# EAGLE board pcb-pick-plaz-control_v1d (EAGLE 9.6.2)
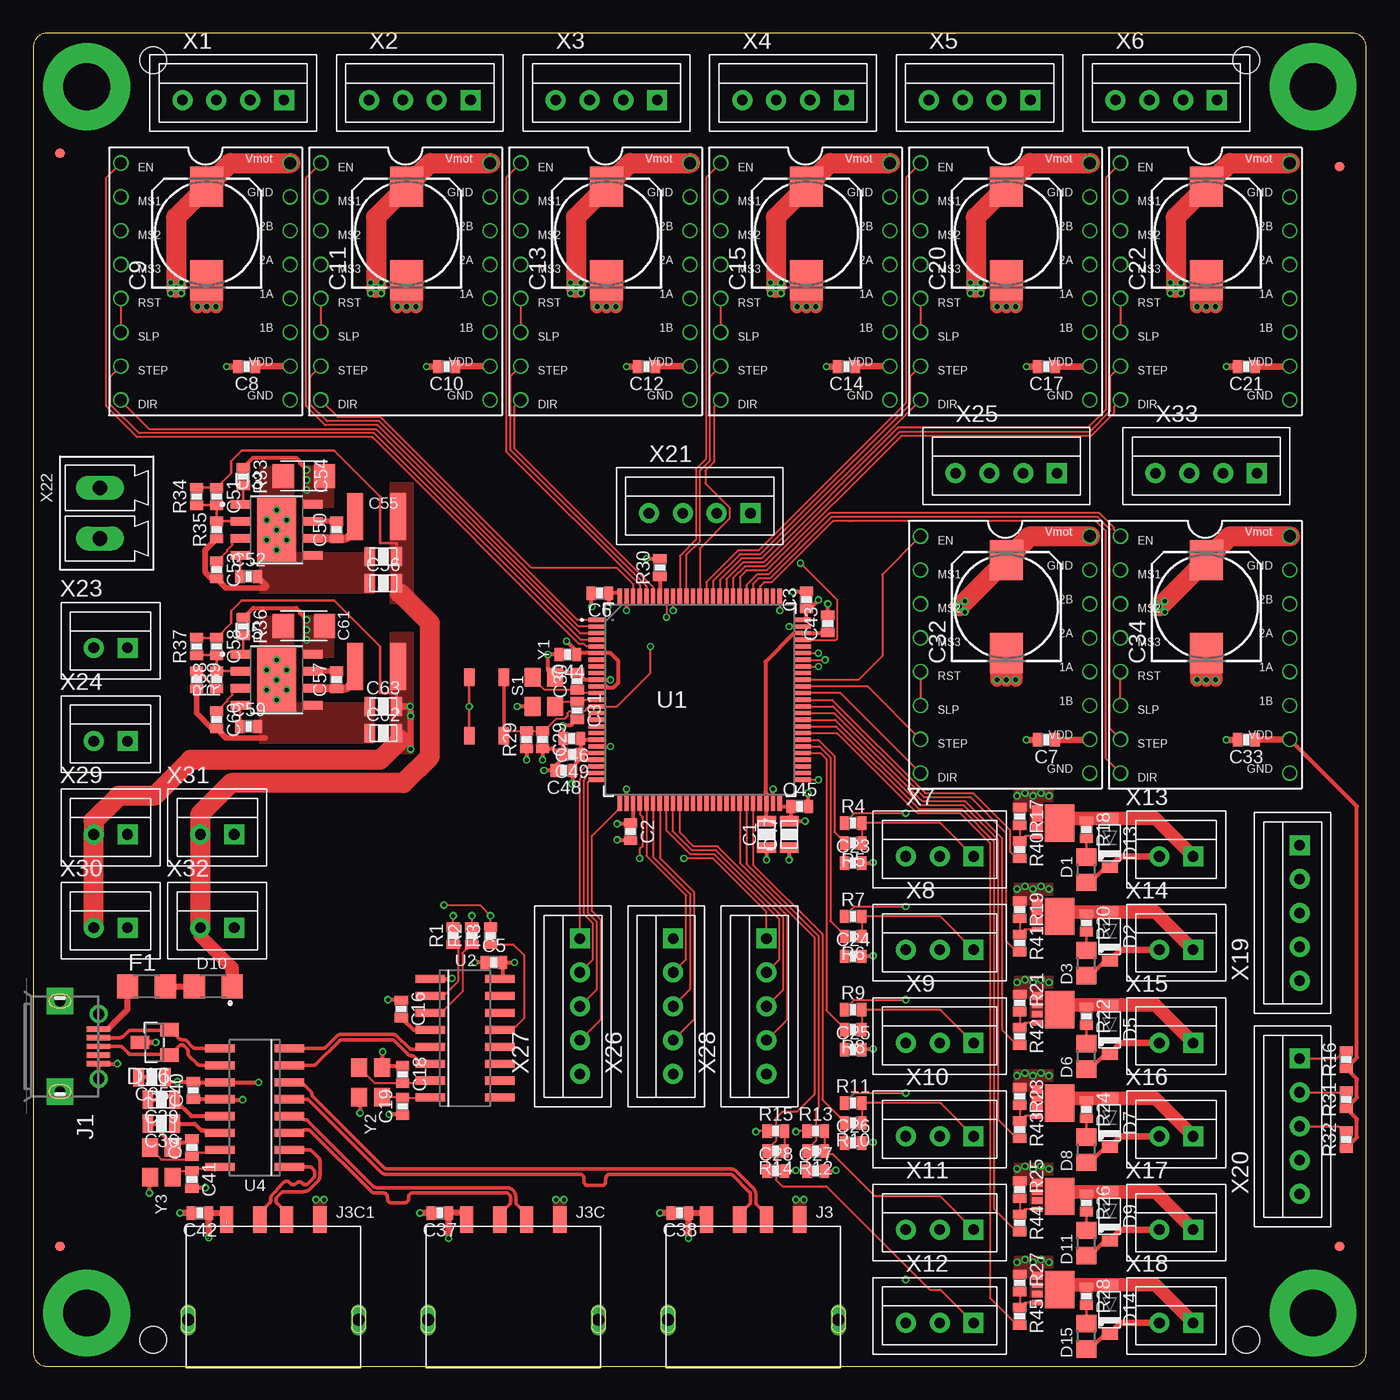
[diagram p5: board, top side]
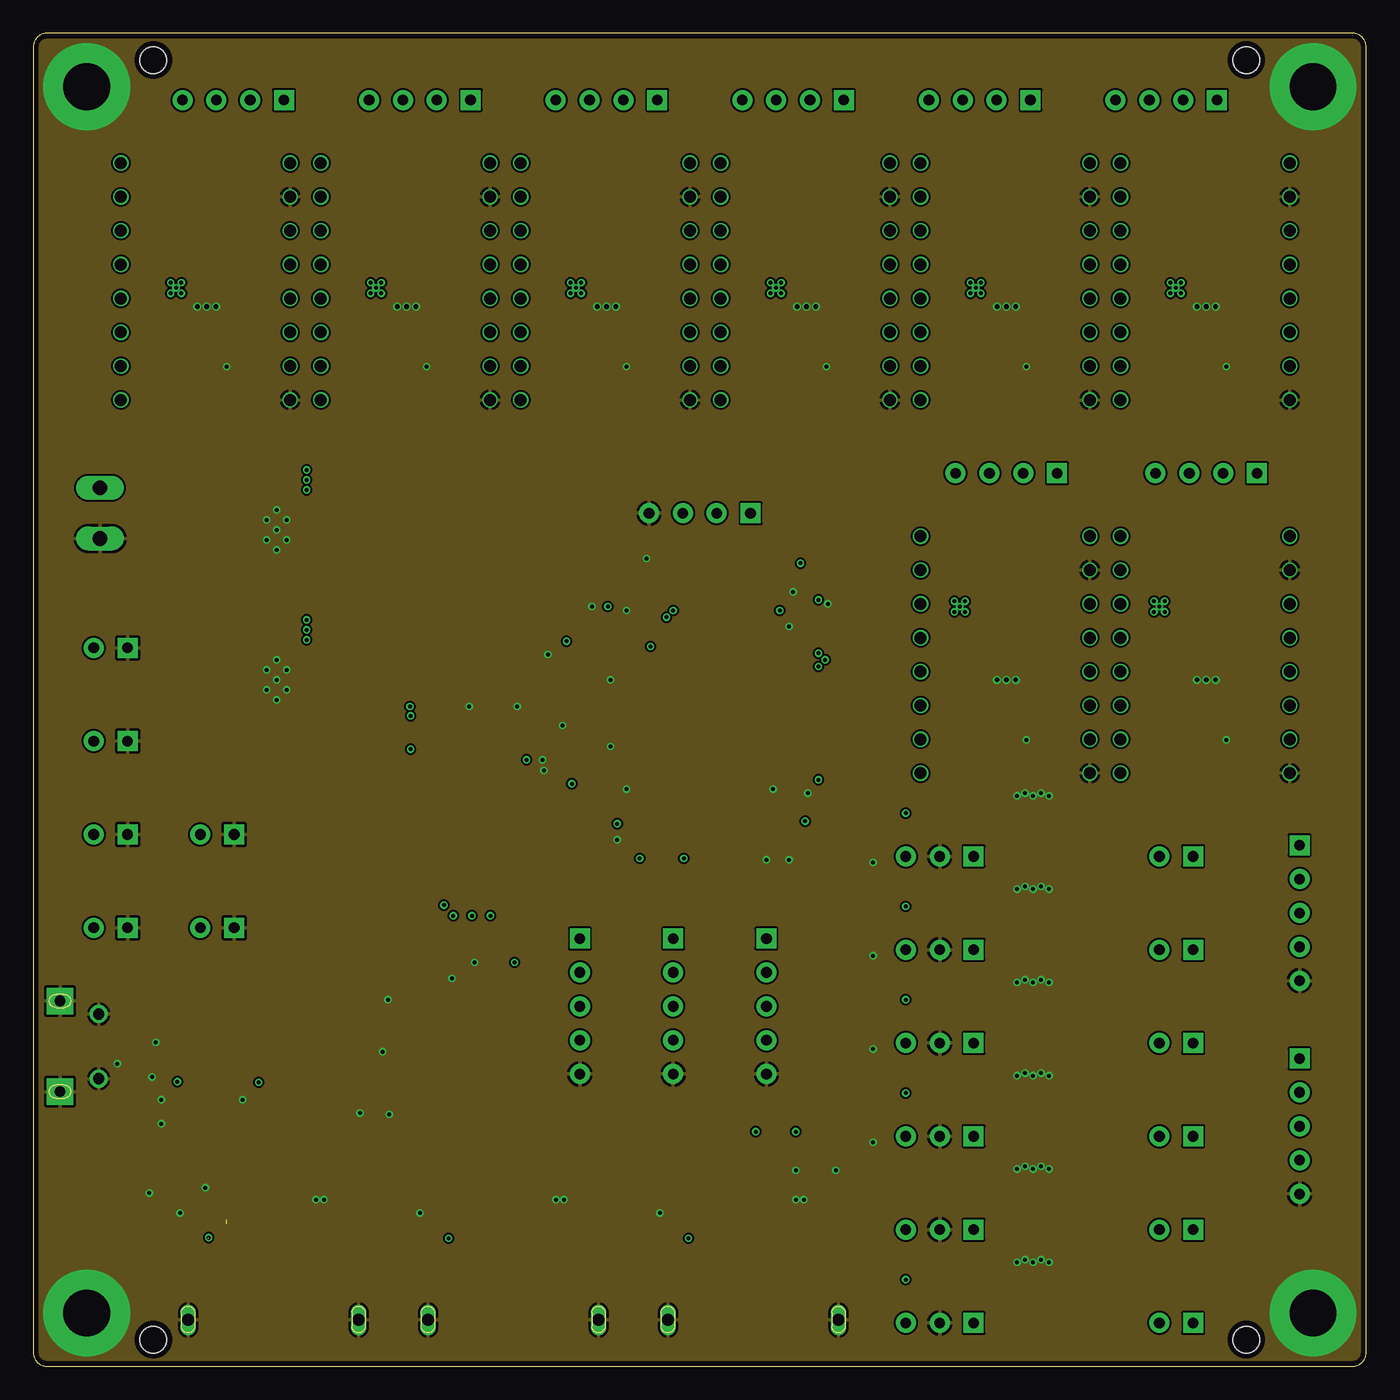
[diagram p6: board, inner layer Route2]
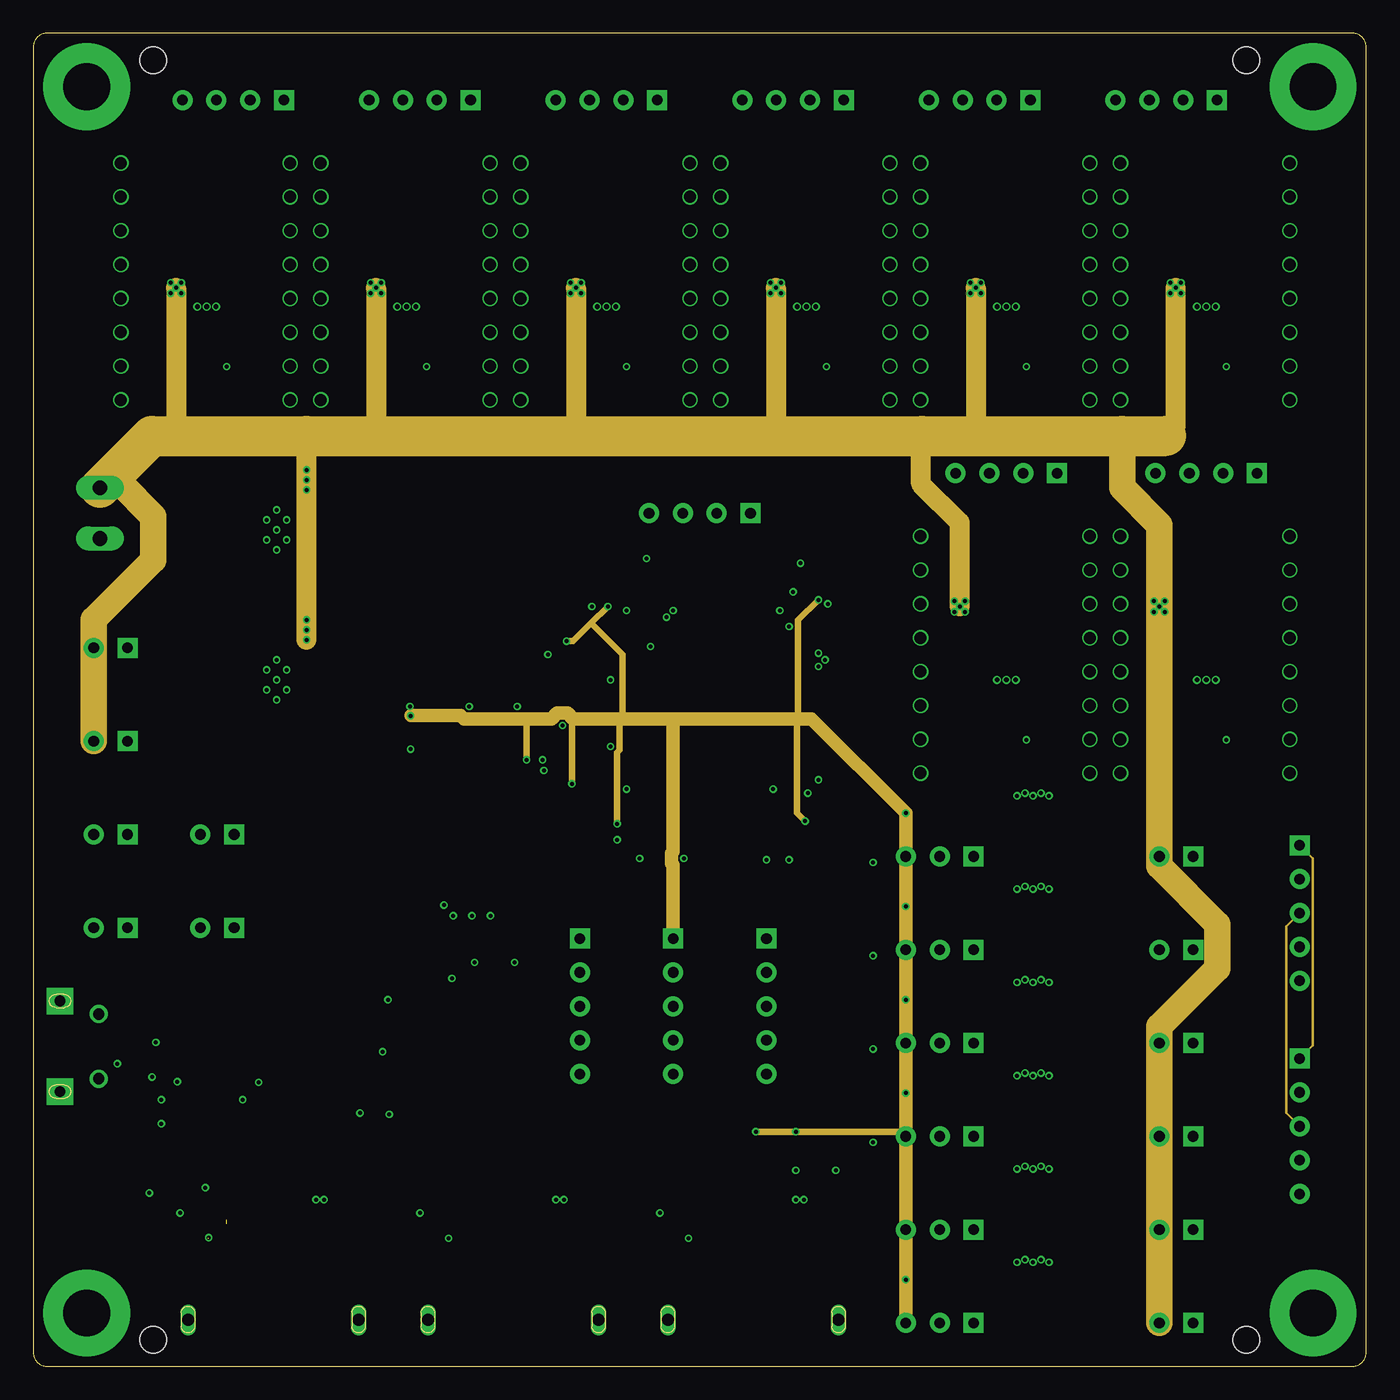
[diagram p7: board, inner layer Route15]
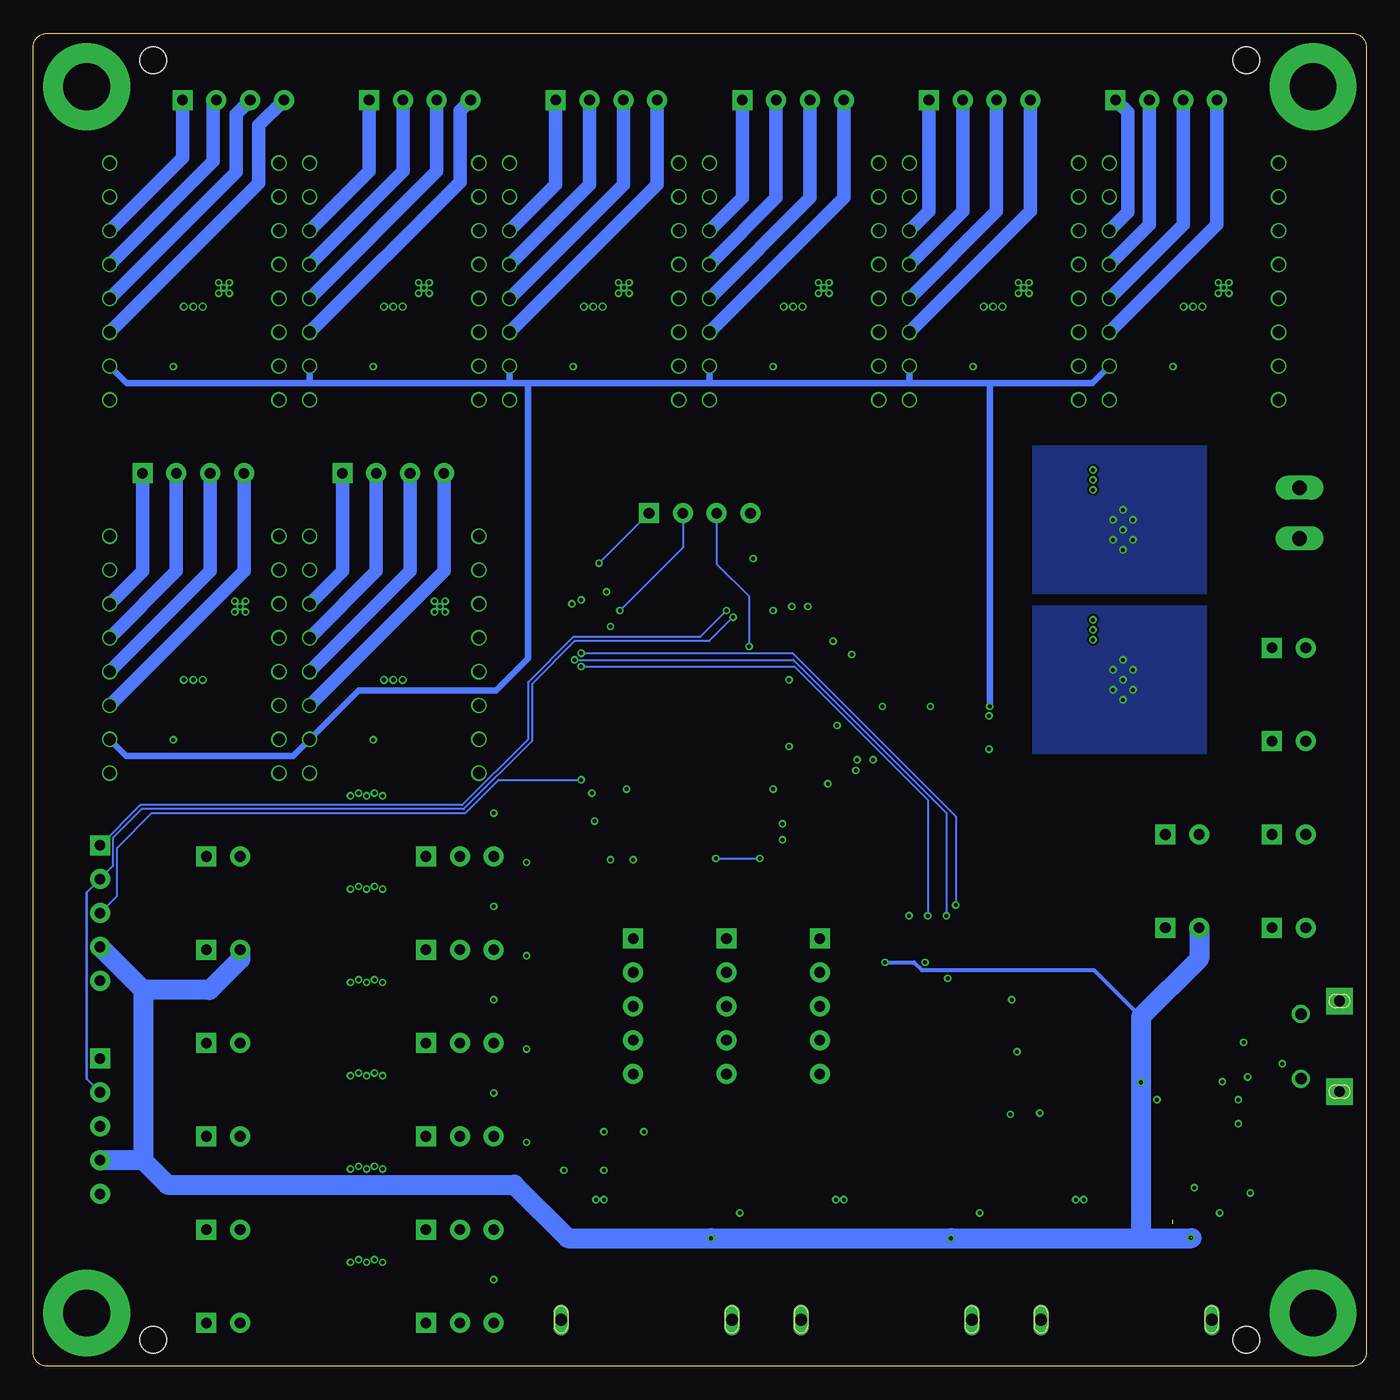
[diagram p8: board, bottom side, seen from below]

Size 100 x 100 mm. Coordinates in mm from the lower left corner, seen from the top.
Outline: 0,99 0,1 arc90 1,0 99,0 arc90 100,1 100,99 arc90 99,100 1,100 arc90 0,99
Copper layers (1+2*15+16): Top 0.035mm / dielectric 0.2mm / Route2 0.035mm / dielectric 1.06mm / Route15 0.035mm / dielectric 0.2mm / Bottom 0.035mm
Design rules "default *": minimum track width 0.15mm, minimum drill 0.2mm, track to track 0.15mm, track to pad 0.15mm, pad to pad 0.15mm, via to via 0.15mm, smd to smd 0.15mm, copper to edge 0.4mm, drill to drill 10mil, minimum pad ring 0.125mm, minimum via ring 0.125mm, stop-mask expansion 0.05mm, vias tented up to drill 0.35mm, thermal gap 0.2mm
Net classes: 1 usb: width 0.25 mm, clearance 0.4 mm to class 0, clearance 0.15 mm; 2 power: width 0.3 mm, clearance 0.3 mm to class 0, clearance 0.3 mm to class 1, clearance 0.3 mm; 3 gnd: clearance 0.5 mm to class 1, clearance 0.5 mm to class 2
Holes 2 mm at 9,98 91,98 91,2 9,2

## Footprints (pad centres in the part's own frame; a part is rotated, then mirrored left to right if it is on the bottom)
0805_CAP = smd 0.8 x 1.4: P$1 1,0; P$2 -1,0
0603_CAP = smd 0.7 x 1: 1 -0.65,0; 2 0.65,0
175TMP-0808 = smd 3 x 2.5: + 3.5,0; - -3.5,0
1206_CAP = smd 1.8 x 1.6: 1 0,1.55; 2 0,-1.55
0805-DOT = smd 1.3 x 1.5: 1 -0.95,0; 2 0.95,0
SOD123 = smd 0.8 x 1.2: A -1.85,0; K 1.85,0
1206-DOT = smd 1.6 x 1.803: 1 -1.422,0; 2 1.422,0
SOT-23 = smd 1.4 x 1: 1 1.1,-0.95; 2 1.1,0.95; 3 -1.1,0
R1206 = smd 1.6 x 1.803: 1 -1.422,0; 2 1.422,0
USB-MICRO-THT = smd 0.4 x 1.75: 1 -1.3,2.875; 2 -0.65,2.875; 3 0,2.875; 4 0.65,2.875; 5 1.3,2.875 | drill 0.8 pad 2 square: GND1 -3.4,0; GND2 3.4,0 | drill 0.85 pad 1.35: GND3 -2.425,2.9; GND4 2.425,2.9
USB-A-LCSC_C42431 = drill 0.9 long: COM1 6.4,-7.53; COM2 -6.4,-7.53 | smd 1 x 2: D+ 1,0; D- -1,0; GND 3.5,0; VCC -3.5,0
IND_CR4 = smd 3.5 x 1.2: P$1 0,1.6; P$2 0,-1.6
0603-RES = smd 0.7 x 1: 1 -0.65,0; 2 0.65,0
SWITCH_WH = smd 1.3 x 0.8: 1A -2.2,1.3; 1B 2.2,1.3; 2A -2.2,-1.3; 2B 2.2,-1.3
LQFP100-14X14MM = smd 1.194 x 0.305: 1 -7.75,6; 2 -7.75,5.5; 3 -7.75,5; 4 -7.75,4.5; 5 -7.75,4; 6 -7.75,3.5; 7 -7.75,3; 8 -7.75,2.5; 9 -7.75,2; 10 -7.75,1.5; 11 -7.75,1; 12 -7.75,0.5; 13 -7.75,0; 14 -7.75,-0.5; 15 -7.75,-1; 16 -7.75,-1.5; 17 -7.75,-2; 18 -7.75,-2.5; 19 -7.75,-3; 20 -7.75,-3.5; 21 -7.75,-4; 22 -7.75,-4.5; 23 -7.75,-5; 24 -7.75,-5.5; 25 -7.75,-6; 51 7.75,-6; 52 7.75,-5.5; 53 7.75,-5; 54 7.75,-4.5; 55 7.75,-4; 56 7.75,-3.5; 57 7.75,-3; 58 7.75,-2.5; 59 7.75,-2; 60 7.75,-1.5; 61 7.75,-1; 62 7.75,-0.5; 63 7.75,0; 64 7.75,0.5; 65 7.75,1; 66 7.75,1.5; 67 7.75,2; 68 7.75,2.5; 69 7.75,3; 70 7.75,3.5; 71 7.75,4; 72 7.75,4.5; 73 7.75,5; 74 7.75,5.5; 75 7.75,6 | smd 0.305 x 1.194: 26 -6,-7.75; 27 -5.5,-7.75; 28 -5,-7.75; 29 -4.5,-7.75; 30 -4,-7.75; 31 -3.5,-7.75; 32 -3,-7.75; 33 -2.5,-7.75; 34 -2,-7.75; 35 -1.5,-7.75; 36 -1,-7.75; 37 -0.5,-7.75; 38 0,-7.75; 39 0.5,-7.75; 40 1,-7.75; 41 1.5,-7.75; 42 2,-7.75; 43 2.5,-7.75; 44 3,-7.75; 45 3.5,-7.75; 46 4,-7.75; 47 4.5,-7.75; 48 5,-7.75; 49 5.5,-7.75; 50 6,-7.75; 76 6,7.75; 77 5.5,7.75; 78 5,7.75; 79 4.5,7.75; 80 4,7.75; 81 3.5,7.75; 82 3,7.75; 83 2.5,7.75; 84 2,7.75; 85 1.5,7.75; 86 1,7.75; 87 0.5,7.75; 88 0,7.75; 89 -0.5,7.75; 90 -1,7.75; 91 -1.5,7.75; 92 -2,7.75; 93 -2.5,7.75; 94 -3,7.75; 95 -3.5,7.75; 96 -4,7.75; 97 -4.5,7.75; 98 -5,7.75; 99 -5.5,7.75; 100 -6,7.75
SOIC-16 = smd 0.61 x 2.21: 1 -4.445,-2.616; 2 -3.175,-2.616; 3 -1.905,-2.616; 4 -0.635,-2.616; 5 0.635,-2.616; 6 1.905,-2.616; 7 3.175,-2.616; 8 4.445,-2.616; 9 4.445,2.616; 10 3.175,2.616; 11 1.905,2.616; 12 0.635,2.616; 13 -0.635,2.616; 14 -1.905,2.616; 15 -3.175,2.616; 16 -4.445,2.616
TPS54227DDAR_VREG_LM5017MR/NOPB = smd 1.55 x 0.6: 1 -2.7,1.905; 2 -2.7,0.635; 3 -2.7,-0.635; 4 -2.7,-1.905; 5 2.7,-1.905; 6 2.7,-0.635; 7 2.7,0.635; 8 2.7,1.905 | smd 2.95 x 4.9: 9 0,0
A4988BREAKOUT = drill 0.9: 1A 8.89,1.27; 1B 11.43,1.27; 2A 6.35,1.27; 2B 3.81,1.27; DIR 16.51,-11.43; EN -1.27,-11.43; GND 16.51,1.27; GND@0 1.27,1.27; MS1 1.27,-11.43; MS2 3.81,-11.43; MS3 6.35,-11.43; RST 8.89,-11.43; SLP 11.43,-11.43; STEP 13.97,-11.43; VDD 13.97,1.27; VMOT -1.27,1.27
DFN3030-8B = smd 2.8 x 2.2: D 0,0.5 | smd 0.4 x 0.8: G 0.975,-1.2; S2 -0.325,-1.2 | smd 0.6 x 0.8: S1 -1.025,-1.2 | smd 0.5 x 0.8: S3 0.325,-1.2
FIDUCIAL_2MM = smd 0.7 x 0.7: V 0,0
B4B-XH = drill 0.8 pad 1.5 square: P$1 3.81,0 | drill 0.8 pad 1.5: P$2 1.27,0; P$3 -1.27,0; P$4 -3.81,0
B3B-XH = drill 0.8 pad 1.5 square: P$1 2.54,0 | drill 0.8 pad 1.5: P$2 0,0; P$3 -2.54,0
B2B-XH = drill 0.8 pad 1.5 square: P$1 1.27,0 | drill 0.8 pad 1.5: P$2 -1.27,0
B5B-XH = drill 0.8 pad 1.5 square: P$1 5.08,0 | drill 0.8 pad 1.5: P$2 2.54,0; P$3 0,0; P$4 -2.54,0; P$5 -5.08,0
PIN_2X1_3.81MM_LONGPAD = drill 1.1 pad 1.8 long: 1 -1.905,0; 2 1.905,0
3225-QUARZ = smd 1.4 x 1.2: 1 -1.1,-0.85; 2_GND 1.1,-0.85; 3 1.1,0.85; 4_GND -1.1,0.85

## Placement (x,y rotation side)
C1  4.7u  [0805_CAP]  55,39.9 90 top
C2  100n  [0603_CAP]  44.8,40.1 270 top
C3  100n  [0603_CAP]  58,57.5 90 top
C4  22p  [0603_CAP]  11.9,16.4 90 top
C5  100n  [0603_CAP]  34.55,30.3 0 top
C6  100n  [0603_CAP]  42.5,58 180 top
C7  [0603_CAP]  76,47 180 top
C8  [0603_CAP]  16,75 180 top
C9  [175TMP-0808]  13,85 90 top
C10  [0603_CAP]  31,75 180 top
C11  [175TMP-0808]  28,85 90 top
C12  [0603_CAP]  46,75 180 top
C13  [175TMP-0808]  43,85 90 top
C14  [0603_CAP]  61,75 180 top
C15  [175TMP-0808]  58,85 90 top
C16  100n  [0603_CAP]  27.6,26.8 270 top
C17  [0603_CAP]  76,75 180 top
C18  22p  [0603_CAP]  27.7,21.9 270 top
C19  22p  [0603_CAP]  27.7,19.5 90 top
C20  [175TMP-0808]  73,85 90 top
C21  [0603_CAP]  91,75 180 top
C22  [175TMP-0808]  88,85 90 top
C23  100n  [0603_CAP]  61.5,37.75 0 top
C24  100n  [0603_CAP]  61.5,30.75 0 top
C25  100n  [0603_CAP]  61.5,23.75 0 top
C26  100n  [0603_CAP]  61.5,16.75 0 top
C27  100n  [0603_CAP]  58.7,14.65 0 top
C28  100n  [0603_CAP]  55.7,14.65 0 top
C29  100n  [0603_CAP]  38.2,47 270 top
C30  10p  [0603_CAP]  40.8,51.4 90 top
C31  10p  [0603_CAP]  40.8,49.2 270 top
C32  [175TMP-0808]  73,57 90 top
C33  [0603_CAP]  91,47 180 top
C34  [175TMP-0808]  88,57 90 top
C35  10u  [0805_CAP]  8.9,21.7 180 top
C36  10u  [0805_CAP]  9.6,18.2 180 top
C37  100n  [0603_CAP]  30.5,11.5 180 top
C38  100n  [0603_CAP]  48.5,11.5 180 top
C39  10u  [0805_CAP]  9.6,20 180 top
C40  100n  [0603_CAP]  12,20.7 90 top
C41  22p  [0603_CAP]  11.9,14 270 top
C42  100n  [0603_CAP]  12.5,11.5 180 top
C43  100n  [0603_CAP]  59.6,55.7 90 top
C44  100n  [0603_CAP]  40.1,53.4 180 top
C45  100n  [0603_CAP]  57.5,42 0 top
C46  100n  [0603_CAP]  40.4,47.1 180 top
C47  4.7u  [0805_CAP]  56.7,39.9 90 top
C48  100n  [0603_CAP]  39.8,44.7 180 top
C49  100n  [0603_CAP]  40.4,45.9 180 top
C50  100n  [0603_CAP]  22.75,62.75 90 top
C51  10p  [0603_CAP]  13.75,65.25 270 top
C52  3.3n  [0603_CAP]  16.15,59.25 0 top
C53  1u  [0603_CAP]  13.75,59.75 270 top
C54  22uF  [1206_CAP]  20.3,66.8 270 top
C55  22uF  [0805_CAP]  26.25,60.75 0 top
C56  22uF  [0805_CAP]  26.25,58.75 0 top
C57  100n  [0603_CAP]  22.75,51.5 90 top
C58  10p  [0603_CAP]  13.75,54 270 top
C59  3.3n  [0603_CAP]  16.15,48 0 top
C60  1u  [0603_CAP]  13.75,48.5 270 top
C61  22uF  [1206_CAP]  20.3,55.55 270 top
C62  22uF  [0805_CAP]  26.25,47.5 0 top
C63  22uF  [0805_CAP]  26.25,49.5 0 top
D1  LED-0805  [0805-DOT]  79,37.25 90 top
D2  [SOD123]  80.75,32.25 270 top
D3  LED-0805  [0805-DOT]  79,30.25 90 top
D5  [SOD123]  80.75,25.25 270 top
D6  LED-0805  [0805-DOT]  79,23.25 90 top
D7  [SOD123]  80.75,18.25 270 top
D8  LED-0805  [0805-DOT]  79,16.25 90 top
D9  [SOD123]  80.75,11.25 270 top
D10  DIODE-1206  [1206-DOT]  13.5,28.5 0 top
D11  LED-0805  [0805-DOT]  79,9.25 90 top
D13  [SOD123]  80.75,39.25 270 top
D14  [SOD123]  80.75,4.25 270 top
D15  LED-0805  [0805-DOT]  79,2.25 90 top
D16  DIODE-TVS  [SOT-23]  9.1,24.3 0 top
F1  [R1206]  8.5,28.5 0 top
J1  USB-ID-THT  [USB-MICRO-THT]  2,24 270 top
J3  USB-LCSC_C42431  [USB-A-LCSC_C42431]  54,11 0 top
J3C  USB-LCSC_C42431  [USB-A-LCSC_C42431]  36,11 0 top
J3C1  USB-LCSC_C42431  [USB-A-LCSC_C42431]  18,11 0 top
L1  4.7uH  [IND_CR4]  25.75,63.75 90 top
L2  4.7uH  [IND_CR4]  25.75,52.5 90 top
R1  1k  [0603-RES]  31.5,32.3 90 top
R2  1k  [0603-RES]  32.9,32.3 90 top
R3  1k  [0603-RES]  34.3,32.3 90 top
R4  10k  [0603-RES]  61.5,40.75 0 top
R5  10k  [0603-RES]  61.5,39.25 180 top
R6  10k  [0603-RES]  61.5,32.25 180 top
R7  10k  [0603-RES]  61.5,33.75 0 top
R8  10k  [0603-RES]  61.5,25.25 180 top
R9  10k  [0603-RES]  61.5,26.75 0 top
R10  10k  [0603-RES]  61.5,18.25 180 top
R11  10k  [0603-RES]  61.5,19.75 0 top
R12  10k  [0603-RES]  58.7,16.15 180 top
R13  10k  [0603-RES]  58.7,17.65 0 top
R14  10k  [0603-RES]  55.7,16.15 180 top
R15  10k  [0603-RES]  55.7,17.65 0 top
R16  10k  [0603-RES]  98.5,23 90 top
R17  1k  [0603-RES]  74,41.25 270 top
R18  1k  [0603-RES]  79,40.25 270 top
R19  1k  [0603-RES]  74,34.25 270 top
R20  1k  [0603-RES]  79,33.25 270 top
R21  1k  [0603-RES]  74,27.25 270 top
R22  1k  [0603-RES]  79,26.25 270 top
R23  1k  [0603-RES]  74,20.25 270 top
R24  1k  [0603-RES]  79,19.25 270 top
R25  1k  [0603-RES]  74,13.25 270 top
R26  1k  [0603-RES]  79,12.25 270 top
R27  1k  [0603-RES]  74,6.25 270 top
R28  1k  [0603-RES]  79,5.25 270 top
R29  10k  [0603-RES]  37,47 90 top
R30  10k  [0603-RES]  47.01,59.92 90 top
R31  10k  [0603-RES]  98.5,20 90 top
R32  10k  [0603-RES]  98.5,17 90 top
R33  10k  [0603-RES]  15.75,66.75 270 top
R34  100k  [0603-RES]  12.25,65.25 90 top
R35  18k  [0603-RES]  13.75,62.75 90 top
R36  10k  [0603-RES]  15.75,55.5 270 top
R37  100k  [0603-RES]  12.25,54 90 top
R38  20k  [0603-RES]  13.75,51.5 90 top
R39  10K  [0603-RES]  12.25,51.5 270 top
R40  10  [0603-RES]  74,38.75 270 top
R41  10  [0603-RES]  74,31.75 270 top
R42  10  [0603-RES]  74,24.75 270 top
R43  10  [0603-RES]  74,17.75 270 top
R44  10  [0603-RES]  74,10.75 270 top
R45  10  [0603-RES]  74,3.75 270 top
S1  SWITCH_2PD  [SWITCH_WH]  34,49.5 270 top
U1  STM32F411VET6  [LQFP100-14X14MM]  50,50 0 top
U2  CH340  [SOIC-16]  32.4,24.6 270 top
U3  TPS54227DDAR  [TPS54227DDAR_VREG_LM5017MR/NOPB]  18.25,62.75 0 top
U4  SL2.1A  [SOIC-16]  16.6,19.4 90 top
U5  TPS54227DDAR  [TPS54227DDAR_VREG_LM5017MR/NOPB]  18.25,51.5 0 top
U$1  LOGO-TOBENG-1MM-FINISH  [TOBENG-1MM-FINISH]  24.7,36.65 0 top
U$2  A4988BREAKOUT  [A4988BREAKOUT]  18,89 270 top
U$3  A4988BREAKOUT  [A4988BREAKOUT]  33,89 270 top
U$4  A4988BREAKOUT  [A4988BREAKOUT]  48,89 270 top
U$5  A4988BREAKOUT  [A4988BREAKOUT]  63,89 270 top
U$6  A4988BREAKOUT  [A4988BREAKOUT]  78,89 270 top
U$7  A4988BREAKOUT  [A4988BREAKOUT]  93,89 270 top
U$8  A4988BREAKOUT  [A4988BREAKOUT]  78,61 270 top
U$9  A4988BREAKOUT  [A4988BREAKOUT]  93,61 270 top
U$21  MOSFET_N_LN8340DT1AG  [DFN3030-8B]  76.5,40.75 270 top
U$22  MOSFET_N_LN8340DT1AG  [DFN3030-8B]  76.5,33.75 270 top
U$23  MOSFET_N_LN8340DT1AG  [DFN3030-8B]  76.5,26.75 270 top
U$24  MOSFET_N_LN8340DT1AG  [DFN3030-8B]  76.5,19.75 270 top
U$25  MOSFET_N_LN8340DT1AG  [DFN3030-8B]  76.5,12.75 270 top
U$26  MOSFET_N_LN8340DT1AG  [DFN3030-8B]  76.5,5.75 270 top
V1  FIDUCIAL2MM  [FIDUCIAL_2MM]  2,91 0 top
V2  FIDUCIAL2MM  [FIDUCIAL_2MM]  2,9 0 top
V3  FIDUCIAL2MM  [FIDUCIAL_2MM]  98,90 0 top
V4  FIDUCIAL2MM  [FIDUCIAL_2MM]  98,9 0 top
X1  04-JST-B4B-XH-A  [B4B-XH]  15,95 0 top
X2  04-JST-B4B-XH-A  [B4B-XH]  29,95 0 top
X3  04-JST-B4B-XH-A  [B4B-XH]  43,95 0 top
X4  04-JST-B4B-XH-A  [B4B-XH]  57,95 0 top
X5  04-JST-B4B-XH-A  [B4B-XH]  71,95 0 top
X6  04-JST-B4B-XH-A  [B4B-XH]  85,95 0 top
X7  03-JST-B3B-XH-A  [B3B-XH]  68,38.25 0 top
X8  03-JST-B3B-XH-A  [B3B-XH]  68,31.25 0 top
X9  03-JST-B3B-XH-A  [B3B-XH]  68,24.25 0 top
X10  03-JST-B3B-XH-A  [B3B-XH]  68,17.25 0 top
X11  03-JST-B3B-XH-A  [B3B-XH]  68,10.25 0 top
X12  03-JST-B3B-XH-A  [B3B-XH]  68,3.25 0 top
X13  02-JST-B3B-XH-A  [B2B-XH]  85.75,38.25 0 top
X14  02-JST-B3B-XH-A  [B2B-XH]  85.75,31.25 0 top
X15  02-JST-B3B-XH-A  [B2B-XH]  85.75,24.25 0 top
X16  02-JST-B3B-XH-A  [B2B-XH]  85.75,17.25 0 top
X17  02-JST-B3B-XH-A  [B2B-XH]  85.75,10.25 0 top
X18  02-JST-B3B-XH-A  [B2B-XH]  85.75,3.25 0 top
X19  05-JST-B5B-XH-A  [B5B-XH]  95,34 90 top
X20  05-JST-B5B-XH-A  [B5B-XH]  95,18 90 top
X21  04-JST-B4B-XH-A  [B4B-XH]  50,64 0 top
X22  PIN_2X13.81MM_LONGPAD  [PIN_2X1_3.81MM_LONGPAD]  5,64 270 top
X23  02-JST-B3B-XH-A  [B2B-XH]  5.8,53.9 0 top
X24  02-JST-B3B-XH-A  [B2B-XH]  5.8,46.9 0 top
X25  04-JST-B4B-XH-A  [B4B-XH]  73,67 0 top
X26  05-JST-B5B-XH-A  [B5B-XH]  48,27 90 top
X27  05-JST-B5B-XH-A  [B5B-XH]  41,27 90 top
X28  05-JST-B5B-XH-A  [B5B-XH]  55,27 90 top
X29  02-JST-B3B-XH-A  [B2B-XH]  5.8,39.9 0 top
X30  02-JST-B3B-XH-A  [B2B-XH]  5.8,32.9 0 top
X31  02-JST-B3B-XH-A  [B2B-XH]  13.8,39.9 0 top
X32  02-JST-B3B-XH-A  [B2B-XH]  13.8,32.9 0 top
X33  04-JST-B4B-XH-A  [B4B-XH]  88,67 0 top
Y1  3213-QUARZ3225  [3225-QUARZ]  38.3,50.6 90 top
Y2  3213-QUARZ3225  [3225-QUARZ]  25.3,21.3 270 top
Y3  3213-QUARZ3225  [3225-QUARZ]  9.6,15.3 270 top

## Tracks (layer width: path | path; a pad name or v marks a point on that pad's centre or on a via)
+3V3  (via drill 0.3)
  Top 0.15: R11.1 61.6,20.5 v65.46,20.5 | R9.1 61.6,27.5 v65.46,27.5 | R7.1 61.6,34.5 v65.46,34.5 | R4.1 61.6,41.5 v65.46,41.5 | R13.1 57.25,17.65 v57.2,17.6 | R15.1 54.25,17.65 v54.2,17.6
  Top 0.2: R37.2 C58.1 14.85,55.75 14.85,56.67 15.63,57.45 22.55,57.45 26,54 26,50.5 27.25,50.5 C63.P$1
  Top 0.3: 41.05,46 C46.1 41.15,47 U1.19 | U1.21 41.05,46 | U1.22 41.1,45.5 41.1,45.85 C49.1 | U1.28 45,40.85 44.9,40.75 C2.1 44.75,40.7 v43.8,40.7 | v40.4,43.7 40.45,43.75 C48.1 40.45,44.95 41.05,45.55 C49.1 | v57.9,40.9 C47.P$1 56.85,41.05 C45.1 56.1,42 56,42.1 U1.50 | v58.9,57.5 58.25,56.85 C3.1 58,56 U1.75 | v43.1,57 43.15,57.05 C6.1 44,58 U1.100 | v40,54.4 40.75,53.65 C44.1 40.85,53.5 U1.6 43.3,53.5 43.9,52.9 43.9,51.29 43.54,50.92 43.06,50.92 42.99,51 U1.11 | R29.1 v37,45.5 | R32.1 98.5,16.38 99.3,17.18 99.3,18.55 R31.1 99.3,20.15 99.3,21.55 R16.1 99.3,23.15 99.3,42 U$9.VDD | C49.1 41.05,46
  Top 0.5: C8.1 16.68,75.03 U$2.VDD | C10.1 31.68,75.03 U$3.VDD | C12.1 46.68,75.03 U$4.VDD | C14.1 61.68,75.03 U$5.VDD | C17.1 79.24,75 U$6.VDD | C21.1 94.24,75 U$7.VDD | C7.1 79.24,47 U$8.VDD | U$9.VDD 91.68,47.03 C33.1 | C63.P$1 v28.25,49.5 | v28.3,46.3 v28.3,48.8 28.3,49.1
  Top 1.5: 27.5,47 26,45.5 11.8,45.5 9.1,42.8 6.4,42.8 4.53,40.93 X29.P$2 X30.P$2
  Route15 0.3: 40.51,48.58 40.58,48.58 | 44.22,48.9 44.22,48.8 44,48.58
  Route15 0.5: v40,54.4 40.5,54.4 41.85,55.75 | 41.85,55.75 v43.1,57 | 44.22,48.9 44.22,53.38 41.85,55.75 | v58.9,57.5 57.38,55.98 57.38,48.6 57.4,48.58 57.3,48.48 57.3,41.5 v57.9,40.9 | 28.32,48.83 v28.3,48.8 | v37,45.5 37,48.58 | v40.4,43.7 40.4,48.4 40.58,48.58 | v43.8,40.7 43.8,46.05 43.98,46.22 43.98,48.55 44,48.58 | v54.2,17.6 v57.2,17.6 65.11,17.6 X10.P$3
  Route15 1: X12.P$3 v65.46,6.5 X11.P$3 X10.P$3 v65.46,20.5 X9.P$3 v65.46,27.5 X8.P$3 v65.46,34.5 X7.P$3 v65.46,41.5 58.38,48.58 57.4,48.58 48,48.58 | 28.32,48.83 32.07,48.83 32.32,48.58 37,48.58 38.88,48.58 39.31,49 40.08,49 40.51,48.58 | 48,48.58 44,48.58 40.58,48.58 | X26.P$1 48,37.59 47.88,37.72 47.88,38.48 48,38.61 48,48.58
  Bottom 0.5: v28.25,49.5 28.25,73.75 | U$2.VDD 20.55,73.75 28.25,73.75 | 28.25,73.75 34.25,73.75 | 34.25,73.75 49.25,73.75 | 49.25,73.75 62.9,73.75 | 62.9,73.75 64.25,73.75 | 64.25,73.75 79.25,73.75 | 79.25,73.75 92.99,73.75 U$7.VDD | U$6.VDD 79.27,73.77 79.25,73.75 | U$5.VDD 64.27,73.77 64.25,73.75 | U$4.VDD 49.27,73.77 49.25,73.75 | U$3.VDD 34.27,73.77 34.25,73.75 | 62.9,73.75 62.9,53.1 65.3,50.7 75.6,50.7 U$8.VDD 80.5,45.8 93.04,45.8 U$9.VDD
  pour Top (no thermals): 26.75,55 26.75,46 28.5,46 28.5,55
+5V  (via drill 0.3)  (2 unrouted)
  Top 0.2: R34.2 C51.1 14.85,67 14.85,67.92 15.63,68.7 22.55,68.7 26,65.25 26,61.75 27.25,61.75 C55.P$1
  Top 0.3: U2.16 35.2,29.23 C5.2 v36.1,30.3 | C35.P$2 10.25,21.35 v10.8,21.35 C40.2 12.04,21.3 U4.11 v16.89,21.3 v16.9,21.3 | D3.1 79.3,29.3 80.4,30.4 D2.K
  Top 0.45: C42.1 14.4,11.5 14.5,11.4 14.5,10.7 | C37.1 32.3,11.5 32.4,11.6 32.5,11.5 J3C.VCC | C38.1 50.5,11.5 J3.VCC
  Top 0.5: D2.K 81.6,31.25 X14.P$2 | C42.1 v13.15,9.65 | C37.1 v31.15,9.6 | C38.1 v49.15,9.6
  Top 1: X32.P$2 12.53,32.27 14.92,29.88 D10.2
  Top 1.5: 27.5,58 29.75,55.75 29.75,45.75 27.75,43.75 14.85,43.75 12.53,41.43 X31.P$2 X32.P$2
  Bottom 0.3: v36.1,30.3 33.91,30.3 33.34,29.73 20.43,29.73 16.9,26.2
  Bottom 1.5: 91.76,15.46 X20.P$4 | 91.76,15.46 89.92,13.62 63.92,13.62 59.9,9.6 v49.15,9.6 v31.15,9.6 16.9,9.6 | X19.P$4 91.76,28.22 | 91.76,28.22 91.76,15.46 | X14.P$2 84.48,30.52 86.78,28.22 91.76,28.22 | 16.9,9.6 13.1,9.6 | X32.P$2 12.53,30.57 16.9,26.2 v16.9,21.3 16.9,9.6
  pour Top (no thermals): 26.75,66.25 26.75,57.25 28.5,57.25 28.5,66.25
+12V  (via drill 0.3)
  Top 0.3: D15.1 79.3,1.3 80.4,2.4 D14.K | D11.1 79.3,8.3 80.4,9.4 D9.K | D8.1 79.3,15.3 80.4,16.4 D7.K | D6.1 79.3,22.3 80.4,23.4 D5.K | D1.1 79.3,36.3 80.4,37.4 D13.K | R36.1 16.5,56.9 19.74,56.9 20,56.64 20,56.5 v20.5,56 | R33.1 16.5,68.15 19.74,68.15 20,67.89 20,67.75 v20.5,67.25 | v55.3,81.3 v55.7,80.9 | v55.3,80.5 v55.7,80.9 | v56.1,80.5 v55.7,80.9 | v56.1,81.3 v55.7,80.9 | v85.3,81.3 v85.7,80.9 | v85.7,80.9 v86.1,81.3 | v85.7,80.9 v86.1,80.5 | v85.7,80.9 v85.3,80.5 | v71.1,81.3 v70.7,80.9 | v70.3,80.5 v70.7,80.9 | v70.3,81.3 v70.7,80.9 | v70.7,80.9 v71.1,80.5 | v40.3,81.3 v40.7,80.9 | v40.7,80.9 v41.1,80.5 | v41.1,81.3 v40.7,80.9 | v40.7,80.9 v40.3,80.5 | v25.3,81.3 v25.7,80.9 | v25.7,80.9 v26.1,80.5 | v26.1,81.3 v25.7,80.9 | v25.7,80.9 v25.3,80.5 | v69.1,57.4 v69.5,57 | v69.5,57 v69.9,56.6 | v69.9,57.4 v69.5,57 | v69.5,57 v69.1,56.6 | v84.08,57.4 84.1,57.4 | 84.1,57.4 84.5,57 | v84.48,57 v84.88,56.6 | v84.88,57.4 v84.48,57 | v84.48,57 v84.08,56.6 | v84.48,57 84.1,57.38 84.1,57.4
  Top 0.5: D14.K 81.6,3.25 X18.P$2 | D9.K 81.6,10.25 X17.P$2 | D7.K 81.6,17.25 X16.P$2 | D5.K 81.6,24.25 X15.P$2 | D13.K 81.6,38.25 X13.P$2
  Top 1.5: U$9.VMOT 89.77,62.27 C34.+ 84.5,57 | U$8.VMOT 74.77,62.27 C32.+ v69.5,57 | U$7.VMOT 89.77,90.27 C22.+ 85.7,86.2 v85.7,80.9 | U$6.VMOT 74.77,90.27 C20.+ 70.7,86.2 v70.7,80.9 | U$5.VMOT 59.77,90.27 C15.+ 55.7,86.2 v55.7,80.9 | U$4.VMOT 44.77,90.27 C13.+ 40.7,86.2 v40.7,80.9 | U$3.VMOT 29.77,90.27 C11.+ 25.7,86.2 v25.7,80.9 | U$2.VMOT 14.77,90.27 C9.+ 10.7,86.2 v10.7,80.9
  Route15 0.3: v10.3,81.3 v10.7,80.9 | v11.1,81.3 v10.7,80.9 | v11.1,80.5 v10.7,80.9 | v10.3,80.5 v10.7,80.9
  Route15 1.5: v69.5,57 69.5,63.3 66.6,66.2 66.6,69.7 66.7,69.8 | 85,69.8 85.7,70.5 v85.7,80.9 | v70.7,80.9 70.7,69.8 | v55.7,80.9 55.7,69.9 55.6,69.8 | v40.7,80.9 40.7,69.8 | v25.7,80.9 25.7,69.9 25.6,69.8 | v10.7,80.9 10.7,69.9 10.6,69.8 | v20.5,54.5 v20.5,65.75 20.5,69.8
  Route15 2: X18.P$2 X17.P$2 X16.P$2 X15.P$2 84.48,25.48 88.84,29.84 88.84,33.16 84.48,37.52 X13.P$2 v84.48,57 84.48,63.12 81.7,65.9 81.7,69.8 | X24.P$2 X23.P$2 4.53,56.03 9,60.5 9,63.75 6.5,66.25 5.34,66.25 X22.1
  Route15 3: X22.1 8.89,69.8 10.6,69.8 20.5,69.8 25.6,69.8 40.7,69.8 55.6,69.8 66.7,69.8 70.7,69.8 81.7,69.8 85,69.8
  other vias: 20.5,66.5 20.5,55.25
  pour Top (no thermals): 20.25,64.5 20.25,67.5 22.5,67.5 22.5,64.5
  pour Top (no thermals): 20.25,53.25 20.25,56.25 22.5,56.25 22.5,53.25
D0_N
  Top 0.25: U4.9 12.18,23.84 arc-45 11.97,23.93 11.49,24.41 arc45 11.28,24.5 11.12,24.5 arc-45 10.91,24.59 10.25,25.25 D16.2 10.15,25.2 7.32,25.2 arc45 7.11,25.11 6.74,24.74 arc-45 6.53,24.65 J1.2
D0_P
  Top 0.25: U4.10 12.5,22.57 arc-45 12.29,22.66 11.71,23.25 arc-45 11.62,23.46 11.62,23.59 arc45 11.53,23.8 11.31,24.02 arc45 11.12,24.1 arc45 10.91,24.01 10.25,23.35 D16.1 10.15,23.4 7.32,23.4 arc-45 7.11,23.49 6.69,23.91 arc45 6.48,24 J1.3
D1_N
  Top 0.25: U4.7 21.02,22.57 arc45 21.23,22.66 22.98,24.41 arc-45 23.19,24.5 26.88,24.5 arc-45 27.09,24.41 28.11,23.39 arc45 28.32,23.3 28.38,23.3 arc-45 28.59,23.21 29.11,22.7 U2.6
D1_P
  Top 0.25: U4.8 21.72,23.84 arc45 21.93,23.93 22.72,24.72 arc-45 23.15,24.9 26.92,24.9 arc-45 27.34,24.72 28.2,23.87 arc45 28.41,23.78 28.78,23.78 29,24 29.75,24 U2.5
D2_N
  Top 0.25: U4.5 20.48,20.04 arc-45 20.69,19.95 26.06,14.58 arc45 26.48,14.4 41,14.4 arc-90 41.31,14.09 41.31,13.87 arc90 41.62,13.55 42.63,13.55 arc90 42.95,13.87 42.95,14.09 arc-90 43.26,14.4 52.28,14.4 arc-45 52.49,14.31 53.71,13.09 arc-45 53.8,12.88 53.8,12.32 arc-45 53.71,12.11 53,11.4 J3.D-
D2_P
  Top 0.25: U4.6 20.12,21.3 20.83,20.6 arc-45 20.9,20.42 arc45 20.99,20.21 26.31,14.89 arc45 26.52,14.8 52.32,14.8 arc-45 52.74,14.62 54.02,13.34 arc-45 54.2,12.92 54.2,12.32 arc45 54.29,12.11 55,11.4 J3.D+
D3_N
  Top 0.25: J3C.D- 35,11.4 35.71,12.11 arc45 35.8,12.32 35.8,12.68 arc45 35.71,12.89 35.69,12.91 arc45 35.48,13 28.47,13 arc90 28.15,12.69 28.15,12.57 arc-90 27.84,12.26 26.88,12.26 arc-90 26.56,12.57 26.56,12.69 arc90 26.25,13 25.68,13 arc-45 25.26,13.18 20.8,17.63 arc45 20.59,17.72 20.32,17.72 20.09,17.5 U4.3
D3_P
  Top 0.25: J3C.D+ 37,11.4 | 37,11.4 37,11.5 | 37,11.4 36.29,12.11 arc-45 36.2,12.32 36.2,12.72 arc45 36.02,13.14 35.94,13.22 arc45 35.52,13.4 25.72,13.4 arc-45 25.51,13.49 20.59,18.41 arc45 20.38,18.5 20.3,18.5 20.04,18.77 U4.4
D4_N
  Top 0.25: U4.1 20.7,14.96 arc-45 20.91,14.87 21.01,14.76 arc-45 21.1,14.55 21.1,14.32 arc-45 21.01,14.11 20.61,13.71 arc-90 20.19,13.71 20.16,13.74 arc90 19.74,13.74 19.71,13.71 arc-90 19.29,13.71 19.21,13.79 arc90 18.79,13.79 18.53,13.53 18.53,13.5 17.98,12.94 arc45 17.8,12.52 17.8,12.42 arc-45 17.71,12.21 16.9,11.4 16.9,10.7 17,10.8 J3C1.D-
D4_P
  Top 0.25: U4.2 20.7,16.23 arc-45 20.91,16.14 21.41,15.63 arc-45 21.5,15.42 21.5,14.28 arc-45 21.32,13.86 20.74,13.28 arc-45 20.32,13.1 18.82,13.1 arc45 18.61,13.01 18.29,12.69 arc45 18.2,12.48 18.2,12.42 arc45 18.29,12.21 19,11.5 J3C1.D+
DTR  (via drill 0.3)
  Top 0.15: U1.70 v58.9,53.5 | R3.2 v34.3,33.8 33.5,34.6 v30.8,34.6
  Bottom 0.15: v58.9,53.5 43.05,53.5 30.8,41.25 v30.8,34.6
GND  (via drill 0.3, 0.35, 3.5 pad 6.5)
  Top 0.2: S1.2A v32.7,49.5 S1.2B
  Top 0.3: C23.2 62.95,37.75 v63,37.8 | C24.2 62.2,30.8 v63,30.8 | C25.2 62.2,23.8 v63,23.8 | C26.2 62.95,16.75 v63,16.8 | C27.2 60.15,14.65 v60.2,14.7 | C28.2 57.15,14.65 v57.2,14.7 | C5.1 v33.1,30.3 | Y2.4_GND 26.25,22.5 | 26.25,22.5 26.25,22.85 26.2,22.9 v26.2,23.6 | C18.1 27.65,22.5 26.25,22.5 | Y2.2_GND 24.5,20.15 v24.5,19 | C19.1 27.7,18.9 v26.7,18.9 | C16.1 27.55,27.5 27.55,27.55 27.5,27.5 v26.6,27.5 | U2.1 31.34,29.05 v31.4,29.1 | C40.1 12.02,20.04 U4.12 14.02,20 v15.7,20 | C4.2 11.65,16.8 10.6,16.8 10.45,16.65 Y3.4_GND 9.9,16.95 9.9,17.2 9.6,17.5 v9.6,18.2 C36.P$1 | C39.P$1 v9.6,20 | C35.P$1 v8.9,21.7 | Y3.2_GND 8.75,14.25 8.7,14.2 v8.7,13 | v12.9,13.4 11.95,13.4 C41.2 | C44.2 v38.6,53.4 38.6,52.25 Y1.2_GND | Y1.4_GND v36.3,49.5 | C31.2 40.33,48.08 v39.7,48.08 39.75,48.02 C46.2 C49.2 | v38.2,45.5 C29.2 38.95,46.35 39.1,46.2 39.45,46.2 C49.2 | C48.2 v38.3,44.7 | C49.2 39.75,45.65 39.1,45 | U1.20 v43.3,46.5 | U1.27 v44.5,43.3 | U1.49 v55.5,43.3 | C45.2 58.15,42.95 v58.1,43 | C1.P$2 v55,38 | C47.P$2 v56.7,38 | C43.2 v59.6,57.2 | U1.74 v56.7,55.5 | C3.2 57.95,58.1 v57,58.1 | R30.2 46.03,60.57 v46,60.6 | U1.99 v44.5,56.7 | C6.2 41.85,57.05 v41.9,57 | v43.3,51.5 U1.10 41.4,51.5 40.85,52.05 C30.2 39.55,52.05 | C2.2 43.85,39.45 v43.8,39.5 | v6.3,22.7 J1.5 4.88,21.6 J1.GND4
  Top 0.4: D16.3 v9.2,24.3 | R35.1 12.9,61.25 12.9,59.6 13.5,59 13.65,59 C53.2 14.45,58.4 17.4,58.4 17.5,58.5 17.5,58.55 C52.2 | R39.2 12.25,49 13.5,47.75 13.65,47.75 C60.2 14.45,47.15 17.4,47.15
  Top 0.5: C10.2 v29.5,75 | C8.2 v14.5,75 | C12.2 v44.5,75 | C14.2 v59.5,75 | C17.2 v74.5,75 | C21.2 v89.5,75 | C33.2 v89.5,47 | C7.2 v74.5,47 | C42.2 v11,11.5 | C37.2 v29,11.5 | C38.2 v47,11.5
  Top 1: C9.- v13,79.5 | C9.- 13.7,80.8 v13.7,79.5 | C9.- 12.3,80.8 v12.3,79.5 | C11.- v28,79.5 | C11.- 28.7,80.8 v28.7,79.5 | C11.- 27.3,80.8 v27.3,79.5 | C13.- v43,79.5 | C13.- 43.7,80.8 v43.7,79.5 | C13.- 42.3,80.8 v42.3,79.5 | C15.- v58,79.5 | C15.- 58.7,80.8 v58.7,79.5 | C15.- 57.3,80.8 v57.3,79.5 | C20.- v73,79.5 | C22.- v88,79.5 | C20.- 73.7,80.8 v73.7,79.5 | C20.- 72.3,80.8 v72.3,79.5 | C22.- 87.3,80.8 v87.3,79.5 | C22.- 88.7,80.8 v88.7,79.5 | C32.- v73,51.5 | C34.- v88,51.5 | C32.- 72.3,52.8 v72.3,51.5 | C32.- 73.7,52.8 v73.7,51.5 | C34.- 87.3,52.8 v87.3,51.5 | C34.- 88.7,52.8 v88.7,51.5
  other vias: 4,96 96,96 96,4 4,4 73.8,42.8 74.4,43 75,42.8 75.6,43 76.2,42.8 73.8,7.8 74.4,8 75,7.8 75.6,8 76.2,7.8 73.8,14.8 74.4,15 75,14.8 75.6,15 76.2,14.8 73.8,21.8 74.4,22 75,21.8 75.6,22 76.2,21.8 73.8,28.8 74.4,29 75,28.8 75.6,29 76.2,28.8 73.8,35.8 74.4,36 75,35.8 75.6,36 76.2,35.8 18.25,62.75 18.25,64.25 19,63.5 17.5,63.5 18.25,61.25 19,62 17.5,62 18.25,53 19,52.25 17.5,52.25 18.25,50 19,50.75 17.5,50.75 18.25,51.5 39.2,12.5 39.8,12.5 57.2,12.5 57.8,12.5 21.2,12.5 21.8,12.5
  pour Route2: -1,101 101,101 101,-1 -1,-1
  pour Top (no thermals): 73.6,42.8 73.6,41.7 74.7,41.7 74.8,41.7 74.8,40.2 75.8,40.2 76.5,40.9 76.5,43.2 73.6,43.2
  pour Top (no thermals): 73.6,7.8 73.6,6.7 74.7,6.7 74.8,6.7 74.8,5.2 75.8,5.2 76.5,5.9 76.5,8.2 73.6,8.2
  pour Top (no thermals): 73.6,14.8 73.6,13.7 74.7,13.7 74.8,13.7 74.8,12.2 75.8,12.2 76.5,12.9 76.5,15.2 73.6,15.2
  pour Top (no thermals): 73.6,21.8 73.6,20.7 74.7,20.7 74.8,20.7 74.8,19.2 75.8,19.2 76.5,19.9 76.5,22.2 73.6,22.2
  pour Top (no thermals): 73.6,28.8 73.6,27.7 74.7,27.7 74.8,27.7 74.8,26.2 75.8,26.2 76.5,26.9 76.5,29.2 73.6,29.2
  pour Top (no thermals): 73.6,35.8 73.6,34.7 74.7,34.7 74.8,34.7 74.8,33.2 75.8,33.2 76.5,33.9 76.5,36.2 73.6,36.2
  pour Top (no thermals): 18,67.5 19.5,67.5 19.5,61 25.5,61 25.5,58 17,58 17,67.5
  pour Top (no thermals): 17,56.25 19.5,56.25 19.5,49.75 25.5,49.75 25.5,46.75 17,46.75
  pour Top (no thermals): 39.1,11.6 39.1,12.6 39.9,12.6 39.9,11.6
  pour Bottom: 12,69 25,69 25,58 12,58
  pour Bottom: 12,57 25,57 25,46 12,46
  pour Top (no thermals): 21.1,11.6 21.1,12.6 21.9,12.6 21.9,11.6
  pour Top (no thermals): 57.1,11.6 57.1,12.6 57.9,12.6 57.9,11.6
INPUT_RESERVED_1
  Top 0.15: C27.1 R12.2 58.05,16.25 58.7,16.9 58.7,19.2 58.9,19.4 58.9,32.3 53.5,37.7 U1.45
INPUT_RESERVED_2
  Top 0.15: C28.1 R14.2 55.05,16.25 55.7,16.9 55.7,18.6 56.2,19.1 57.3,19.1 58.6,20.4 58.6,32.17 53,37.77 U1.44
INPUT_X_END
  Top 0.15: C23.1 60.85,39.1 R5.2 60.85,39.35 60.1,40.1 60.1,45.8 58.9,47 U1.57
INPUT_Y_END1
  Top 0.15: C24.1 R6.2 60.85,32.35 59.8,33.4 59.8,45.68 58.98,46.5 U1.56
INPUT_Y_END2
  Top 0.15: C25.1 R8.2 60.85,25.35 59.5,26.7 59.5,45.55 59.05,46 U1.55
INPUT_Z_END
  Top 0.15: C26.1 60.85,18.2 R10.2 60.85,18.35 59.2,20 59.2,32.42 54,37.62 U1.46
MOT_A_DIR
  Top 0.15: U$7.DIR 81.07,71.99 81.07,71.52 79.35,69.8 65.12,69.8 55.02,59.7 53.5,59.7 53,59.2 U1.82
MOT_A_EN
  Top 0.15: U$7.EN 80.47,89.17 80.47,71.77 79.1,70.4 64.87,70.4 54.77,60.3 53.25,60.3 52,59.05 U1.84
MOT_A_STEP
  Top 0.15: U$7.STEP 80.77,74.23 80.77,71.65 79.22,70.1 65,70.1 54.9,60 53.38,60 52.5,59.12 U1.83
MOT_B_DIR
  Top 0.15: U$8.DIR 60.56,50.5 U1.64
MOT_B_EN
  Top 0.15: U$8.EN 63.7,59.4 63.7,53.3 61.9,51.5 U1.66
MOT_B_STEP
  Top 0.15: U$8.STEP 62.6,51 U1.65
MOT_C_DIR
  Top 0.15: U$9.DIR 80.47,45.59 80.47,62.66 79.73,63.4 61.4,63.4 61.2,63.4 59.99,63.4 55.39,58.8 54.8,58.8 54.5,58.5 U1.79
MOT_C_EN
  Top 0.15: U$9.EN 81.07,62.77 81.07,62.91 79.98,64 59.75,64 55.15,59.4 54.3,59.4 53.5,58.6 U1.81
MOT_C_STEP
  Top 0.15: U$9.STEP 80.77,47.83 80.77,62.78 79.86,63.7 59.87,63.7 55.27,59.1 54.42,59.1 54,58.68 U1.80
MOT_E_DIR
  Top 0.15: U$6.DIR 66.54,72.49 54.65,60.6 53.13,60.6 51.5,58.97 U1.85
MOT_E_EN
  Top 0.15: U$6.EN 65.47,89.17 65.47,72.27 54.4,61.2 52.88,61.2 50.5,58.82 U1.87
MOT_E_STEP
  Top 0.15: U$6.STEP 65.77,74.23 65.77,72.15 54.52,60.9 53,60.9 51,58.9 U1.86
MOT_X_DIR
  Top 0.15: U$2.DIR 6.57,72.43 8.7,70.3 25.7,70.3 41,55 U1.3
MOT_X_EN
  Top 0.15: U1.5 41.5,54 41.3,54.2 40.95,54.2 25.45,69.7 7.8,69.7 5.47,72.03 5.47,89.17 U$2.EN
MOT_X_STEP
  Top 0.15: U1.4 41.08,54.5 25.58,70 7.93,70 5.77,72.16 5.77,74.23 U$2.STEP
MOT_Y0_DIR
  Top 0.15: U$3.DIR 22.86,71.2 26.07,71.2 37.37,59.9 43.78,59.9 45,58.68 U1.98
MOT_Y0_EN
  Top 0.15: U1.2 40.92,55.5 25.82,70.6 21.9,70.6 20.47,72.03 20.47,89.17 U$3.EN
MOT_Y0_STEP
  Top 0.15: U1.1 40.85,56 25.95,70.9 22.03,70.9 20.77,72.16 20.77,74.23 U$3.STEP
MOT_Y1_DIR
  Top 0.15: U$4.DIR 36.07,71.99 36.07,68.88 46.5,58.45 U1.95
MOT_Y1_EN
  Top 0.15: U$4.EN 35.47,89.17 35.47,68.63 45.5,58.6 U1.97
MOT_Y1_STEP
  Top 0.15: U$4.STEP 35.77,74.23 35.77,68.75 46,58.52 U1.96
MOT_Z_DIR
  Top 0.15: U$5.DIR 51.07,71.99 51.07,67.82 50.42,67.18 50.42,66.22 52.24,64.4 52.24,63.6 50,61.35 U1.88
MOT_Z_EN
  Top 0.15: U$5.EN 50.47,89.17 50.47,68.07 49.7,67.31 49.7,62.01 48.5,60.8 U1.91
MOT_Z_STEP
  Top 0.15: U$5.STEP 50.77,74.23 50.77,67.95 50.01,67.18 50.01,61.88 49,60.88 U1.90
N$1
  Top 0.3: R30.1 U1.94
N$2
  Bottom 1: U$2.2B 17.89,86.56 17.89,94.08 X1.P$1
N$3
  Bottom 1: U$2.2A 16.27,85.65 X1.P$2
N$4
  Bottom 1: U$2.1A 13.73,85.65 X1.P$3
N$5
  Bottom 1: U$2.1B 11.19,85.65 X1.P$4
N$6
  Bottom 1: U$6.2B 74.81,89.65 X5.P$1
N$7
  Top 0.15: U2.7 29.61,21.25 C18.2 25.6,21.25 Y2.1
N$8
  Top 0.15: 30.05,20.15 C19.2 27.65,20.2 Y2.3
  Top 0.25: U2.8 30.05,20.16 30.05,20.15
N$9
  Top 0.15: U$2.RST U$2.SLP
N$10
  Top 0.15: R1.1 31.65,31.65 31.9,31.4 31.9,28.89 30.78,27.77 U2.2
N$11
  Top 0.15: U2.3 30.59,26.5 32.2,28.11 32.2,31 32.5,31.3 32.55,31.3 R2.1
N$12
  Top 0.15: U3.7 20.96,63.4
  Top 0.4: 20.96,63.4 C50.2
N$13
  Bottom 1: U$6.2A 72.27,89.65 X5.P$2
N$14
  Bottom 1: U$6.1A 69.73,89.65 X5.P$3
N$15
  Top 0.3: C1.P$1 U1.48 55,42.99 54.92,43.06 54.92,52.85 57.03,54.95 57.7,54.95 U1.73 59.55,55 C43.1
N$16
  Top 0.3: C16.2 28.52,25.23 U2.4
N$17
  Bottom 1: U$3.2B 32.81,86.65 X2.P$1
N$18
  Bottom 1: U$3.2A 30.27,86.65 X2.P$2
N$19
  Bottom 1: U$3.1A 27.73,86.65 X2.P$3
N$20
  Bottom 1: U$3.1B 25.19,86.65 X2.P$4
N$21
  Top 0.15: U$3.RST U$3.SLP
N$22
  Bottom 1: U$4.2B 46.81,87.65 X3.P$1
N$23
  Bottom 1: U$4.2A 44.27,87.65 X3.P$2
N$24
  Bottom 1: U$4.1A 41.73,87.65 X3.P$3
N$25
  Bottom 1: U$4.1B 39.19,87.65 X3.P$4
N$26
  Top 0.15: U$4.RST U$4.SLP
N$27
  Bottom 1: U$5.2B 60.81,88.65 X4.P$1
N$28
  Bottom 1: U$5.2A 58.27,88.65 X4.P$2
N$29
  Bottom 1: U$5.1A 55.73,88.65 X4.P$3
N$30
  Bottom 1: U$5.1B 53.19,88.65 X4.P$4
N$31
  Top 0.15: U$5.RST U$5.SLP
N$32
  Bottom 1: U$6.1B 68,88.84 68,94.19 X5.P$4
N$33
  Top 0.15: U$6.RST U$6.SLP
N$34
  Bottom 1: U$7.2B 88.81,90.65 X6.P$1
N$35
  Bottom 1: U$7.2A 86.5,90.42 86.5,94.77 X6.P$2
N$36
  Bottom 1: U$7.1A 84.8,89.58 84.8,93.93 X6.P$3
N$37
  Bottom 1: U$7.1B 83.1,88.74 83.1,93.09 X6.P$4
N$38
  Top 0.15: U$7.RST U$7.SLP
N$45
  Top 0.15: X7.P$1 68.04,40.75 R4.2 R5.1
N$46
  Top 0.15: X8.P$1 68.04,33.75 R7.2 R6.1
N$47
  Top 0.15: X9.P$1 68.04,26.75 R9.2 R8.1
N$48
  Top 0.15: X10.P$1 68.04,19.75 R11.2 R10.1
N$49
  Top 0.15: X11.P$1 68.05,12.74 | 68.04,12.75 68.05,12.74 | R13.2 59.35,16.2 R12.1 59.35,16.05 59.5,15.9 60,15.9 63.16,12.74 68.05,12.74
N$50
  Top 0.15: X12.P$1 68.04,5.75 67.25,5.75 59.5,13.5 56.2,13.5 55.7,14 55.7,15.5 R14.1 R15.2
N$51
  Top 0.2: R18.1 79.2,41.1 D13.A
  Top 0.3: U$21.D 77,40.5
  Top 1: 77,40.5 77.6,41.1 D13.A 84.17,41.1 X13.P$1
N$52
  Top 0.15: U$21.G 74.38,39.77 R40.1 R17.2
N$53
  Top 0.2: R18.2 D1.2
N$54
  Top 0.2: R20.1 79.2,34.1 D2.A
  Top 1: U$22.D 77.35,34.1 D2.A 84.17,34.1 X14.P$1
N$55
  Top 0.15: U$22.G 74.38,32.77 R41.1 R19.2
N$56
  Top 0.2: R20.2 D3.2
N$57
  Top 0.2: R22.1 79.2,27.1 D5.A
  Top 1: U$23.D 77.35,27.1 D5.A 84.17,27.1 X15.P$1
N$58
  Top 0.15: U$23.G 74.38,25.77 R42.1 R21.2
N$59
  Top 0.2: R22.2 D6.2
N$60
  Top 0.2: R24.1 79.2,20.1 D7.A
  Top 1: U$24.D 77.35,20.1 D7.A 84.17,20.1 X16.P$1
N$61
  Top 0.15: U$24.G 74.38,18.77 R43.1 R23.2
N$62
  Top 0.2: R24.2 D8.2
N$63
  Top 0.2: R26.1 79.2,13.1 D9.A
  Top 0.3: U$25.D 77,12.6 76.9,12.5
  Top 1: 76.9,12.5 77.5,13.1 D9.A 84.17,13.1 X17.P$1
N$64
  Top 0.15: U$25.G 74.38,11.78 R44.1 R25.2
N$65
  Top 0.2: R26.2 D11.2
N$66
  Top 0.2: R28.1 79.2,6.1 D14.A
  Top 1: U$26.D 77.35,6.1 D14.A 84.17,6.1 X18.P$1
N$67
  Top 0.15: R27.2 R45.1 74.38,4.78 U$26.G
N$68
  Top 0.2: R28.2 D15.2
N$69
  Bottom 1: U$8.2B 76.81,59.65 X25.P$1
N$70
  Top 0.15: U1.12 41.05,50.5 C30.1 38.35,50.75 37.45,51.65 Y1.3
N$71
  Top 0.15: U1.13 40.95,50 C31.1 39.45,49.85 39.4,49.9 39.4,49.75 Y1.1
N$72
  Bottom 1: U$8.2A 74.27,59.65 X25.P$2
N$73
  Top 0.15: U4.16 13.83,14.8 12.05,14.8 C41.1 10.9,14.65 Y3.3
N$74
  Top 0.15: 34.23,25.23 U2.13 35.05,25.2 35.9,25.2 36.8,26.1 36.8,30.85 36,31.65 R3.1 34.35,31.65
N$75
  Top 0.6: L1.P$1 24.15,62.75 23.5,62.1 C50.1 22.73,62.12 U3.6
N$76
  Top 0.15: U4.15 13.22,16.23 13,16 12.1,16 11.9,15.8 C4.1 11.62,15.47 9.62,15.47 8.75,16.35 Y3.1
N$77
  Top 0.3: C36.P$2 12.1,18.2 12.6,17.7 12.78,17.7 12.98,17.5 U4.14
N$78
  Top 0.3: C39.P$2 11.84,18.77 U4.13
N$79
  Bottom 1: U$8.1A 71.73,59.65 X25.P$3
N$80
  Top 0.2: R34.1 C51.2 R35.2 15.54,63.4 U3.2
N$81
  Top 0.45: F1.2 D10.1 | D10.1 12.2,28.5 12.3,28.4 12.18,28.4 D10.1
N$82
  Top 0.2: C52.1 15.5,60.8 U3.4
N$83
  Top 0.2: C53.1 14.53,61.17 14.53,61.24 14.9,61.62 14.9,62 15.02,62.12 U3.3
N$84
  Top 0.2: R33.2 15.75,64.86 U3.1
N$85
  Bottom 1: U$8.1B 69.19,59.65 X25.P$4
N$86
  Top 0.2: U5.7 20.96,52.15 21.36,52.15
  Top 0.4: 21.36,52.15 C57.2
N$87
  Top 0.6: L2.P$1 24.15,51.5 23.5,50.85 C57.1 22.73,50.87 U5.6
N$88
  Top 0.15: U$8.RST U$8.SLP
N$89
  Top 0.2: R37.1 C58.2 R38.2 15.54,52.15
  Top 0.25: U5.2 15.54,52.15
N$90
  Top 0.2: C59.1 15.5,49.55 U5.4
N$91
  Top 0.2: C60.1 14.53,49.92 14.53,49.99 14.9,50.37 14.9,50.85 14.91,50.87 U5.3
N$92
  Top 0.2: R36.2 15.75,53.7 15.75,53.6 15.75,53.5 15.65,53.41 U5.1
N$93
  Bottom 1: U$9.2B 91.81,59.65 X33.P$1
N$94
  Top 0.2: R38.1 R39.1
N$95
  Bottom 1: U$9.2A 89.27,59.65 X33.P$2
N$96
  Bottom 1: U$9.1A 86.73,59.65 X33.P$3
N$97
  Bottom 1: U$9.1B 84.19,59.65 X33.P$4
N$98
  Top 0.15: U$9.SLP U$9.RST
NRST  (via drill 0.3)
  Top 0.15: S1.1B 35.65,47.65 R29.2 C29.1 38.3,47.65 39.23,48.58 39.84,48.58 40.08,48.81 40.08,48.99 40.21,49.12 41.31,49.12 41.56,49.38 42.13,49.38 U1.14 43.8,49.5 46.3,52 v46.3,54
  Top 0.25: S1.1B S1.1A
  Bottom 0.15: X21.P$3 48.73,60.2 46.3,57.77 v46.3,54
OUTPUT_LED_BOT_UP
  Top 0.15: U1.61 60.08,49 66.68,42.4 69.9,42.4 72.67,39.62 72.67,25.23 73.8,24.1 R42.2
OUTPUT_LED_TOP_DN
  Top 0.15: U1.60 60.16,48.5 66.56,42.1 69.78,42.1 72.38,39.5 72.38,18.52 73.8,17.1 R43.2
OUTPUT_LED_TRAY_1
  Top 0.15: U1.59 60.23,48 66.43,41.8 69.65,41.8 72.08,39.38 72.08,11.82 73.8,10.1 R44.2
OUTPUT_LED_TRAY_2
  Top 0.15: U1.58 60.31,47.5 66.31,41.5 69.53,41.5 71.78,39.25 71.78,5.12 73.8,3.1 R45.2
OUTPUT_PUMP
  Top 0.15: U1.63 59.93,50 66.93,43 70.5,43 73.28,40.23 73.28,38.62 73.8,38.1 R40.2
OUTPUT_VALVE
  Top 0.15: U1.62 60,49.5 66.8,42.7 70.3,42.7 72.97,40.02 72.97,31.93 73.8,31.1 R41.2
PA0/ADC0
  Top 0.15: X27.P$1 41,44.08 41.12,44.21 41.12,44.7 41.42,45 U1.23
PA1/ADC1
  Top 0.15: X27.P$2 41.98,30.52 41.98,33.23 41.3,33.9 41.3,43.96 41.43,44.09 41.43,44.25 41.56,44.38 41.58,44.38 41.7,44.5 U1.24
PA2/ADC2
  Top 0.15: U1.25 41.8,44 41.6,43.8 41.6,34.02 42.27,33.35 42.27,28.27 X27.P$3
PA3/ADC3
  Top 0.15: X27.P$4 42.58,26.04 42.58,33.47 41.9,34.15 41.9,39.8 44,41.9 U1.26
PA4  (via drill 0.3)
  Top 0.15: X28.P$1 55,34.08 50.98,38.1 v48.8,38.1 | U1.29 45.5,41.4 45.7,41.2 45.7,39 45.5,38.8 v45.5,38.1
  Bottom 0.15: v48.8,38.1 v45.5,38.1
PA5/SPI1_SCK
  Top 0.15: X26.P$2 48.98,30.52 48.98,35.3 48.98,35.33 46,38.3 U1.30
PA6/SPI1_MISO
  Top 0.15: U1.31 46.5,38.22 49.27,35.45 49.27,28.27 X26.P$3
PA7/SPI1_MOSI
  Top 0.15: U1.32 47,38.15 49.58,35.57 49.58,26.04 X26.P$4
PB0
  Top 0.15: X28.P$4 56.58,26.04 56.58,33.77 51.35,39 49.55,39 48.5,40.05 U1.35
PB6/I2C1_SCL  (via drill 0.3)
  Top 0.15: U1.92 v48,56.7 | X20.P$1 97.78,23.08 98.35,23.65 R16.2
  Route15 0.2: X19.P$1 96,38.08 96,24.08 X20.P$1
  Bottom 0.15: v48,56.7 50,54.7 59.5,54.7 62.9,51.3 62.9,47.03 67.83,42.1 91.98,42.1 X19.P$1
PB7/I2C1_SDA  (via drill 0.3)
  Top 0.15: U1.93 v47.5,56.2 | X20.P$2 98.39,20.54 R31.2
  Bottom 0.15: v47.5,56.2 49.3,54.4 59.38,54.4 62.6,51.18 62.6,46.9 67.7,41.8 91.86,41.8 94.03,39.63 94.03,37.52 94.92,36.62 X19.P$2
  Bottom 0.2: X20.P$2 96,21.54 96,35.54 94.92,36.62
PB12/BUSY  (via drill 0.3)
  Top 0.15: v58.9,44 U1.51 | X20.P$3 97.9,18 98.25,17.65 R32.2
  Route15 0.2: X19.P$3 94,33 94,19 X20.P$3
  Bottom 0.15: X19.P$3 93.72,35.27 93.72,38.9 91.12,41.5 67.58,41.5 65.08,44 v58.9,44
PC4
  Top 0.15: X28.P$2 55.98,30.52 55.98,33.52 51.1,38.4 49.3,38.4 47.5,40.2 U1.33
PC5
  Top 0.15: X28.P$3 56.27,28.27 56.27,33.65 51.22,38.7 49.42,38.7 48,40.12 U1.34
RX  (via drill 0.3)
  Top 0.15: U1.69 v59.4,53 | R1.2 v31.5,33.8
  Bottom 0.15: v59.4,53 42.98,53 31.5,41.52 v31.5,33.8
SYS_JTC  (via drill 0.3)
  Top 0.15: U1.76 v56,56.7
  Bottom 0.15: X21.P$2 51.27,61.43 v56,56.7
SYS_JTMS-SWDIO  (via drill 0.3)
  Top 0.15: U1.72 58.98,54.5 59.01,54.48 60.19,54.48 60.33,54.61 60.33,57.48 v57.55,60.25
  Bottom 0.15: X21.P$1 v57.55,60.26 v57.55,60.25
TX  (via drill 0.3)
  Top 0.15: U1.68 v58.9,52.5 | R2.2 v32.9,33.8
  Bottom 0.15: v58.9,52.5 42.9,52.5 32.9,42.5 v32.9,33.8
VINUSB
  Top 0.4: J1.1 5.6,25.3 6.1,25.8
  Top 0.45: 6.1,25.8 7.08,26.78 F1.1

## Text on the board
tFinish: MOT X | MOT Y0 | MOT Y1 | MOT Z | MOT E | MOT A | GND | NRST | SWCK | SWDIO | MOT B | MOT C | 12V | Debugger | 12V | 12V | pcb-pick-plaz-control v1d / by ftobler 2021 | 3.3V | 5V | XEND | PUMP | 3V3 | GPIO/ADC | GPIO/SPI | GPIO | 3.3V | 5V | UART | YEND0 | VALVE | 3V3 | 5V | XEND1 | BOTUP | 3V3 | 12V | ZEND | USB | TOPDN | 3V3 | 12V | 3V3 | AUX1 | RES0 | 12V | 3V3 | AUX2 | RES1 | JLCJLCJLCJLC | 12V